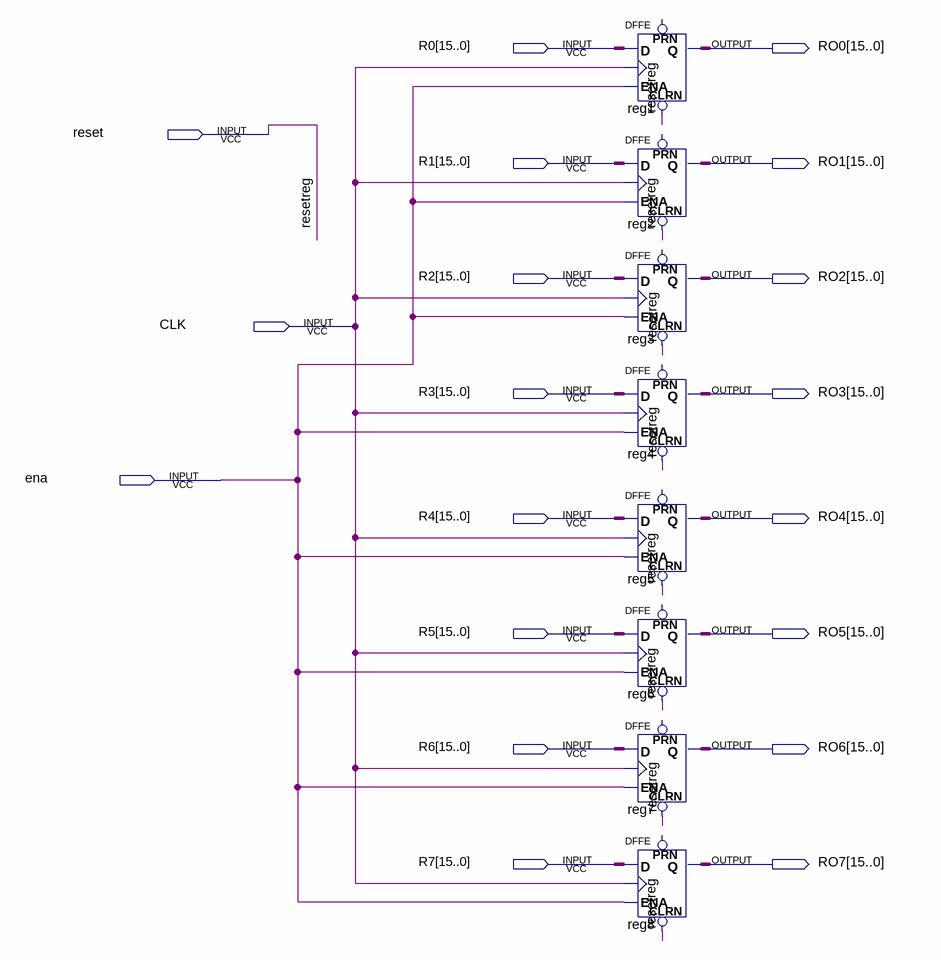
[diagram p0: schematic sheet]
// Quartus schematic 8regesters.bdf as structural Verilog: 8 symbols, 19 pins
module \8regesters  (
  input  [15:0] R0,
  input  reset,
  input  [15:0] R1,
  input  [15:0] R2,
  input  CLK,
  input  [15:0] R3,
  input  ena,
  input  [15:0] R4,
  input  [15:0] R5,
  input  [15:0] R6,
  input  [15:0] R7,
  output [15:0] RO0,
  output [15:0] RO1,
  output [15:0] RO2,
  output [15:0] RO3,
  output [15:0] RO4,
  output [15:0] RO5,
  output [15:0] RO6,
  output [15:0] RO7
);

  DFFE reg1[15:0] (.CLRN(reset), .D(R0), .CLK(CLK), .ENA(ena), .Q(RO0));  // open: PRN
  DFFE reg2[15:0] (.CLRN(reset), .D(R1), .CLK(CLK), .ENA(ena), .Q(RO1));  // open: PRN
  DFFE reg3[15:0] (.CLRN(reset), .D(R2), .CLK(CLK), .ENA(ena), .Q(RO2));  // open: PRN
  DFFE reg4[15:0] (.CLRN(reset), .D(R3), .CLK(CLK), .ENA(ena), .Q(RO3));  // open: PRN
  DFFE reg5[15:0] (.CLRN(reset), .D(R4), .CLK(CLK), .ENA(ena), .Q(RO4));  // open: PRN
  DFFE reg6[15:0] (.CLRN(reset), .D(R5), .CLK(CLK), .ENA(ena), .Q(RO5));  // open: PRN
  DFFE reg7[15:0] (.CLRN(reset), .D(R6), .CLK(CLK), .ENA(ena), .Q(RO6));  // open: PRN
  DFFE reg8[15:0] (.CLRN(reset), .D(R7), .CLK(CLK), .ENA(ena), .Q(RO7));  // open: PRN

  // Other names for the same wires on the sheet: resetreg = reset
endmodule
